# Altium schematic sheet MCU.SchDoc
size A4; SheetNumber: 4; SheetTotal: 8
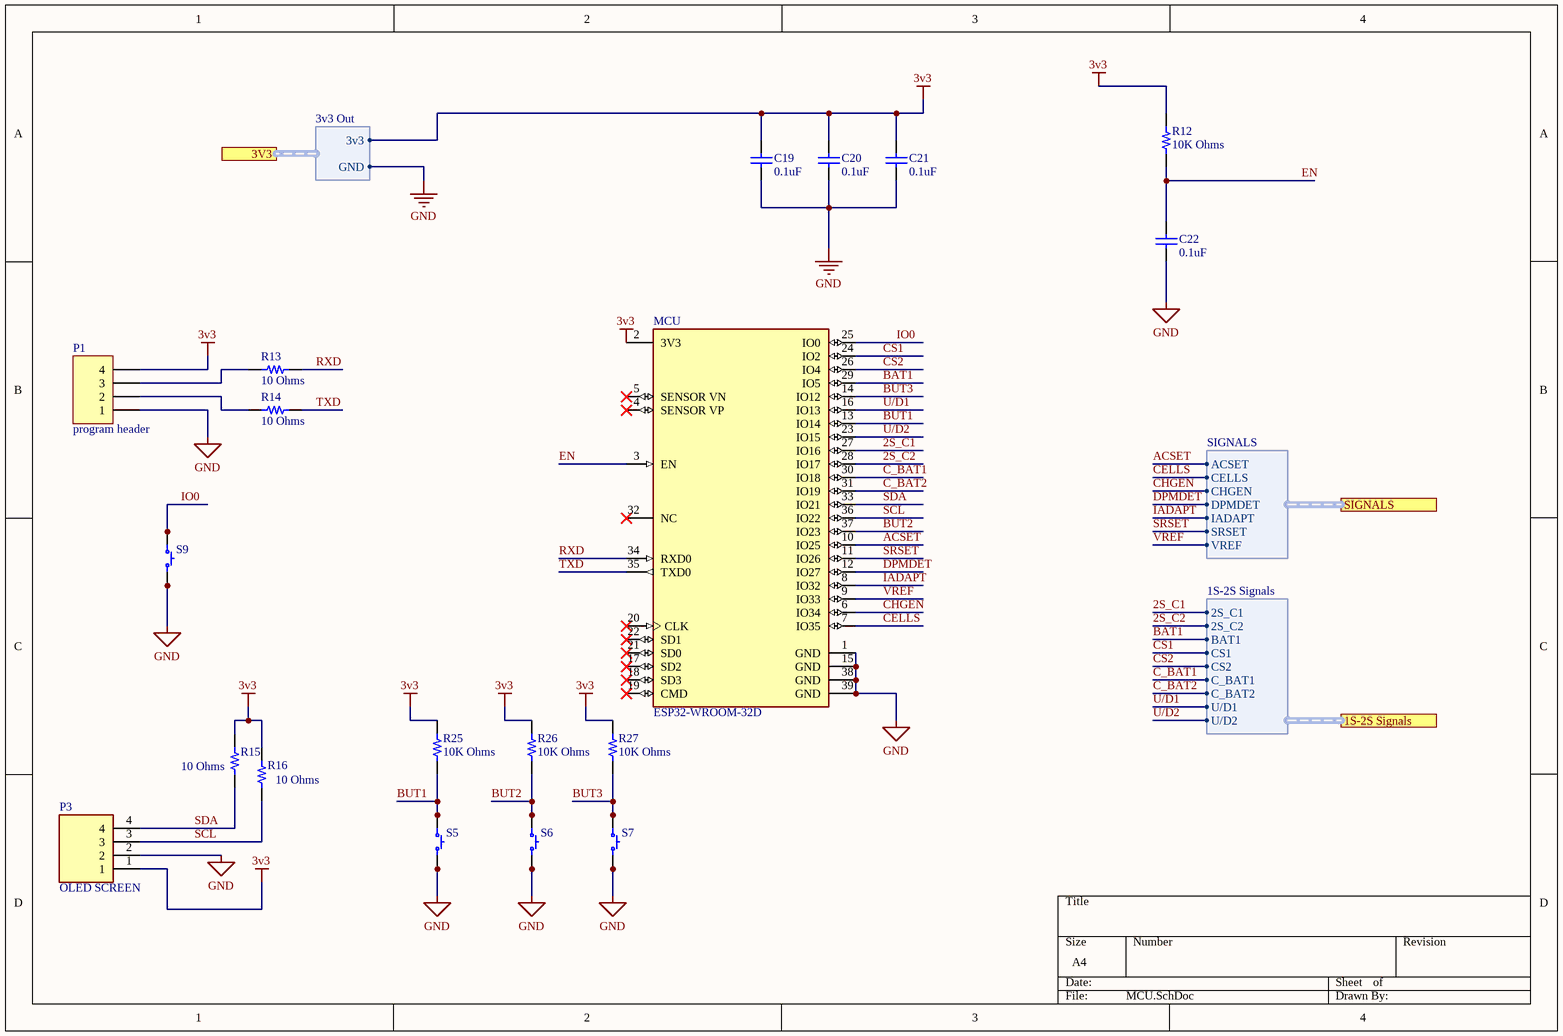
[diagram p0: MCU.SchDoc]

## Parts
C19  0.1uF  [CAPC2013X94X50NL20T25]
C20  0.1uF  [CAPC2013X94X50NL20T25]
C21  0.1uF  [CAPC2013X94X50NL20T25]
C22  0.1uF  [CAPC2013X94X50NL20T25]
MCU  ESP32-WROOM-32D  [FP-ESP32-WROOM-32D-MFG]
P1  program header  [HDR1X4]
P3  OLED SCREEN  [OLED SCREEN]
R12  10K Ohms  [RES 0603_1608]
R13  10 Ohms  [RES 0603_1608]
R14  10 Ohms  [RES 0603_1608]
R15  10 Ohms  [RES 0603_1608]
R16  10 Ohms  [RES 0603_1608]
R25  10K Ohms  [RES 0603_1608]
R26  10K Ohms  [RES 0603_1608]
R27  10K Ohms  [RES 0603_1608]
S5  1977223-9  [TE FSM4JSMA]  (value not drawn)
S6  1977223-9  [TE FSM4JSMA]  (value not drawn)
S7  1977223-9  [TE FSM4JSMA]  (value not drawn)
S9  1977223-9  [TE FSM4JSMA]  (value not drawn)

## Ports
1S-2S Signals (harness 1S-2S Signals), 3V3 (harness 3v3 Out), SIGNALS (harness SIGNALS)

## Harnesses
SIGNALS: ACSET, CELLS, CHGEN, DPMDET, IADAPT, SRSET, VREF
1S-2S Signals: 2S_C1, 2S_C2, BAT1, CS1, CS2, C_BAT1, C_BAT2, U/D1, U/D2
3v3 Out: 3v3, GND

## Nets
3v3: C19.2 C20.2 C21.2 MCU.2(3V3) P1.4 P3.1 R12.1 R15.1 R16.1 R25.1 R26.1 R27.1 ; port 3V3.3v3
GND: C19.1 C20.1 C21.1 C22.1 MCU.1(GND) MCU.15(GND) MCU.38(GND) MCU.39(GND) P1.1 P3.2 S5.3 S5.4 S6.3 S6.4 S7.3 S7.4 S9.3 S9.4 ; port 3V3.GND
2S_C1: MCU.27(IO16) ; port 1S-2S Signals.2S_C1
2S_C2: MCU.28(IO17) ; port 1S-2S Signals.2S_C2
ACSET: MCU.10(IO25) ; port SIGNALS.ACSET
BAT1: MCU.29(IO5) ; port 1S-2S Signals.BAT1
BUT1: MCU.13(IO14) R25.2 S5.1 S5.2
BUT2: MCU.37(IO23) R26.2 S6.1 S6.2
BUT3: MCU.14(IO12) R27.2 S7.1 S7.2
C_BAT1: MCU.30(IO18) ; port 1S-2S Signals.C_BAT1
C_BAT2: MCU.31(IO19) ; port 1S-2S Signals.C_BAT2
CELLS: MCU.7(IO35) ; port SIGNALS.CELLS
CHGEN: MCU.6(IO34) ; port SIGNALS.CHGEN
CS1: MCU.24(IO2) ; port 1S-2S Signals.CS1
CS2: MCU.26(IO4) ; port 1S-2S Signals.CS2
DPMDET: MCU.12(IO27) ; port SIGNALS.DPMDET
EN: C22.2 MCU.3(EN) R12.2
IADAPT: MCU.8(IO32) ; port SIGNALS.IADAPT
IO0: MCU.25(IO0) S9.1 S9.2
RXD: MCU.34(RXD0) R13.1
SCL: MCU.36(IO22) P3.3 R16.2
SDA: MCU.33(IO21) P3.4 R15.2
SRSET: MCU.11(IO26) ; port SIGNALS.SRSET
TXD: MCU.35(TXD0) R14.1
U/D1: MCU.16(IO13) ; port 1S-2S Signals.U/D1
U/D2: MCU.23(IO15) ; port 1S-2S Signals.U/D2
VREF: MCU.9(IO33) ; port SIGNALS.VREF
NetP1_2: P1.2 R14.2
NetP1_3: P1.3 R13.2

Not connected (* = marked no-connect by the designer): MCU 4(SENSOR_VP)* 5(SENSOR_VN)* 17(SD2)* 18(SD3)* 19(CMD)* 20(CLK)* 21(SD0)* 22(SD1)* 32(NC)*

## Library data of the parts
C19-C22 = CMP-1036-04427-2: 0.1µF, 50V, 10%, X7R, 0805; Manufacturer: AVX Interconnect / Elco; Part Number: 08051C104JAT2A
MCU = CMP-194065-000003-1: WIFI MODULE 32MBITS SPI FLASH; Manufacturer: Espressif Systems; Max Supply Voltage: 3.6V; Nominal Supply Current: 500mA; Max Frequency: 2484MHz; Number Of Adc Channels: 16; Number Of Gpio: 32; Interface: I2C,SPI,UART,Ethernet,I2S,Other; Data Rate: 150Mbits/s; Min Supply Voltage: 3V; Bandwidth: 72MHz; Sensitivity: -98dBm; Octopart: https://octopart.com/esp32-wroom-32d-espressif+systems-91040050; Package: ESP32-WROOM-32D; ComponentLink2URL: https://www.espressif.com/sites/default/files/documentation/esp32-wroom-32d_esp32-wroom-32u_datasheet_en.pdf; Lead Free: Yes; Category: UNK; Mouser Description: Wi-Fi/BT BLE Module ESP32-D0WD, SPI Flash, UART, P; Device Class L1: Integrated Circuits (ICs); RoHS: TRUE; Temperature Range Low: -40°C; ComponentLink2Description: Datasheet; Digikey Description: WIFI MODULE 32MBITS SPI FLASH; Height: 3.2mm; Temperature: -40°C to +85°C; Manufacturer Part Number: ESP32-WROOM-32D; Device Class L3: Transceivers; Device Class L2: RF Semiconductors and Devices; Temperature Range High: +85°C; Automotive: No
P1 = Header 4: Header, 4-Pin; LatestRevisionDate: 17-Jul-2002; LatestRevisionNote: Re-released for DXP Platform.; Publisher: Altium Limited
R12 R25-R27 = RNCS0603BKE10K0: RES 10K OHM 0.1% 1/16W 0603; Manufacturer: Stackpole Electronics Inc; Power (Watts): 0.063W, 1/16W; Temperature Coefficient: ±25ppm/°C; Part Number: RNCS0603BKE10K0; Value: 10K Ohms; ComponentLink1Description: Datasheet; ComponentLink1URL: https://www.seielect.com/catalog/sei-rncs_rnch.pdf; ComponentLink2Description: DigiKey Link; ComponentLink2URL: http://digikey.com/product-detail/en/stackpole-electronics-inc/RNCS0603BKE10K0/RNCS0603BKE10K0CT-ND/1800113; Composition: Thin Film; Device Package: 0603 (1608 Metric); Features: Anti-Corrosive, Automotive AEC-Q200, Moisture Resistant; Height - Seated (Max): 0.022" (0.55mm); LastUpdated: 2.09.2020 01:10:25; Lifecycle Status: Active; Minimum Order: 1; Number of Terminations: 2; Operating Temperature: -55°C ~ 155°C; Package / Case: 0603 (1608 Metric); Packaging: TapeAndReel; PartId: 4838; Part Status: Active; Price: 0.08; Ratings: AEC-Q200; Resistance: 10 kOhms; Series: RNCS; Size / Dimension: 0.061" L x 0.031" W (1.55mm x 0.80mm); Supplier 1: DigiKey; Supplier Part Number 1: RNCS0603BKE10K0CT-ND; Supplier Device Package: 0603; Tolerance: ±0.1%
R13-R16 = RNCS0603BKE10K0: RES 10 OHM 0.1% 1/16W 0603; Manufacturer: Stackpole Electronics Inc; Power (Watts): 0.063W, 1/16W; Resistance: 10 kOhms; Temperature Coefficient: ±25ppm/°C; Part Number: RNCS0603BKE10K0; Value: 10 Ohms; ComponentLink1Description: Datasheet; ComponentLink1URL: https://www.seielect.com/catalog/sei-rncs_rnch.pdf; ComponentLink2Description: DigiKey Link; ComponentLink2URL: http://digikey.com/product-detail/en/stackpole-electronics-inc/RNCS0603BKE10K0/RNCS0603BKE10K0CT-ND/1800113; Composition: Thin Film; Device Package: 0603 (1608 Metric); Features: Anti-Corrosive, Automotive AEC-Q200, Moisture Resistant; Height - Seated (Max): 0.022" (0.55mm); LastUpdated: 2.09.2020 01:10:25; Lifecycle Status: Active; Minimum Order: 1; Number of Terminations: 2; Operating Temperature: -55°C ~ 155°C; Package / Case: 0603 (1608 Metric); Packaging: TapeAndReel; PartId: 4838; Part Status: Active; Price: 0.08; Ratings: AEC-Q200; Series: RNCS; Size / Dimension: 0.061" L x 0.031" W (1.55mm x 0.80mm); Supplier 1: DigiKey; Supplier Part Number 1: RNCS0603BKE10K0CT-ND; Supplier Device Package: 0603; Tolerance: ±0.1%
S5-S7 S9 = 1977223-9: SWITCH TACTILE SPST-NO 0.05A 24V; Manufacturer: TE Connectivity ALCOSWITCH Switches; Actuator Height off PCB, Vertical: 5.00mm; Actuator Orientation: Top Actuated; Actuator Type: Standard; Contact Rating @ Voltage: 0.05A @ 24VDC; Illumination: Non-Illuminated; Operating Force: 160gf; Outline: 6.00mm x 6.00mm; Switch Function: Off-Mom; Part Number: 1977223-9; Circuit: SPST-NO; ComponentLink1Description: Datasheet; ComponentLink1URL: https://www.te.com/commerce/DocumentDelivery/DDEController?Action=srchrtrv&DocNm=1308111-1_SWITCHES_CORE_PROGRAM_CATALOG&DocType=CS&DocLang=English; ComponentLink2Description: DigiKey Link; ComponentLink2URL: http://digikey.com/product-detail/en/te-connectivity-alcoswitch-switches/1977223-9/1977223-9-ND/5597033; LastUpdated: 30.08.2020 21:06:45; Lifecycle Status: Active; Minimum Order: 30000; Mounting Type: Surface Mount; Packaging: Bulk; Price: 0.16; Series: FSMJSMA; Supplier 1: DigiKey; Supplier Part Number 1: 1977223-9-ND; Termination Style: Gull Wing